# EAGLE schematic ChargerBase (EAGLE 7.2.0)
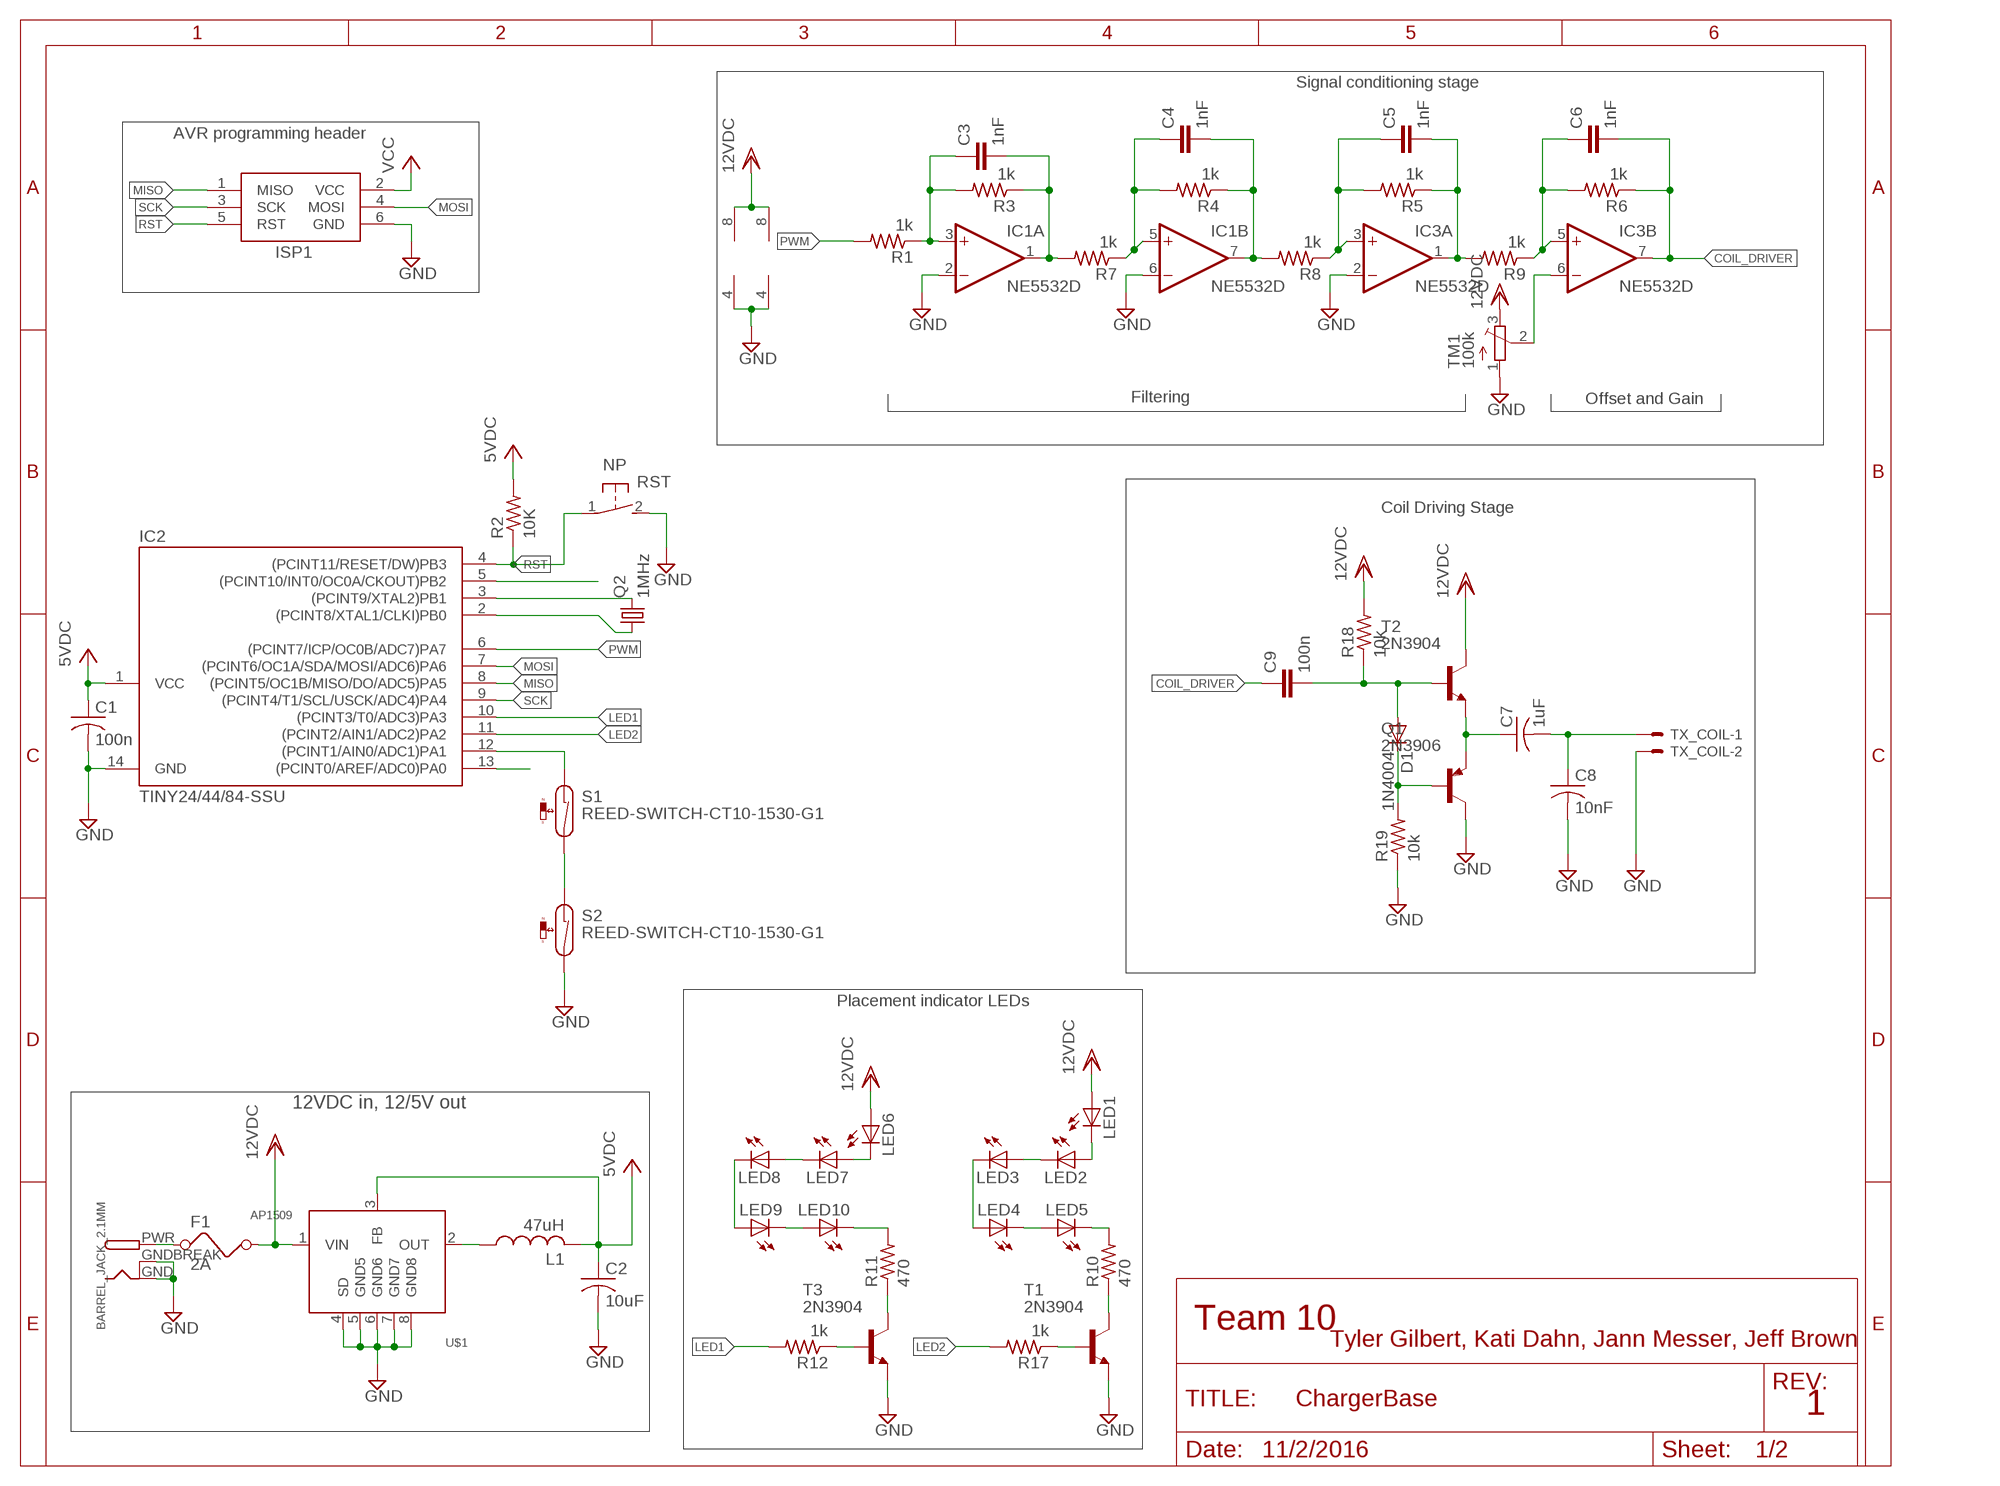
[diagram p0: schematic, sheet 1]

## Parts
BARREL_JACK_2.1MM  DCBARRELPTH  [DCJACK_2MM_PTH]
C1  100n  C-USC0805  [C0805]
C2  10uF  C-US025-040X050  [C025-040X050]
C3  1nF  C-EUC0805  [C0805]
C4  1nF  C-EUC0805  [C0805]
C5  1nF  C-EUC0805  [C0805]
C6  1nF  C-EUC0805  [C0805]
C7  1uF  C-US050-025X075  [C050-025X075]
C8  10nF  C-US050-025X075  [C050-025X075]
C9  100n  C-EUC0805  [C0805]
D1  1N4004  [DO41-10]
F1  2A  FUSE  [FUSE]
IC1  NE5532D  [SO08]
IC2  TINY24/44/84-SSU  [SOIC14]
IC3  NE5532D  [SO08]
ISP1  AVRISP-6  [AVRISP]
L1  47uH  L-US0207/7  [0207/7]
LED1  LEDCHIPLED_0805  [CHIPLED_0805]
LED2  LEDCHIPLED_0805  [CHIPLED_0805]
LED3  LEDCHIPLED_0805  [CHIPLED_0805]
LED4  LEDCHIPLED_0805  [CHIPLED_0805]
LED5  LEDCHIPLED_0805  [CHIPLED_0805]
LED6  LEDCHIPLED_0805  [CHIPLED_0805]
LED7  LEDCHIPLED_0805  [CHIPLED_0805]
LED8  LEDCHIPLED_0805  [CHIPLED_0805]
LED9  LEDCHIPLED_0805  [CHIPLED_0805]
LED10  LEDCHIPLED_0805  [CHIPLED_0805]
NP  RST  DTSM-3  [DTSM-3]
Q1  2N3906  [TO92]
Q2  1MHz  CRYSTALSM49  [SM49]
R1  1k  R-US_R0805  [R0805]
R2  10K  R-US_R0805  [R0805]
R3  1k  R-US_R0805  [R0805]
R4  1k  R-US_R0805  [R0805]
R5  1k  R-US_R0805  [R0805]
R6  1k  R-US_R0805  [R0805]
R7  1k  R-US_R0805  [R0805]
R8  1k  R-US_R0805  [R0805]
R9  1k  R-US_R0805  [R0805]
R10  470  R-US_R0805  [R0805]
R11  470  R-US_R0805  [R0805]
R12  1k  R-US_R0805  [R0805]
R17  1k  R-US_R0805  [R0805]
R18  10k  R-US_R0805  [R0805]
R19  10k  R-US_R0805  [R0805]
S1  REED-SWITCH-CT10-1530-G1  [CT10-G1]
S2  REED-SWITCH-CT10-1530-G1  [CT10-G1]
T1  2N3904  [TO92]
T2  2N3904  [TO92]
T3  2N3904  [TO92]
TM1  100k  TRIMPOTTC33X  [TC33X]
TX_COIL  22-23-2021  [22-23-2021]
U$1  AP1509  [SOP08]

## Nets
COIL_DRIVER: C6.2 C9.1 IC3.7(B:OUT) R6.1
GND: BARREL_JACK_2.1MM.GND BARREL_JACK_2.1MM.GNDBREAK C1.2 C2.2 C8.2 IC1.2(A:-IN) IC1.4(P:V-) IC1.6(B:-IN) IC2.14(GND) IC3.2(A:-IN) IC3.4(P:V-) ISP1.6(GND) NP.2 Q1.1(C) R19.1 S2.2 T1.3(E) T3.3(E) TM1.1(A) TX_COIL.2 U$1.4(SD) U$1.5(GND5) U$1.6(GND6) U$1.7(GND7) U$1.8(GND8)
LED1: IC2.10((PCINT3/T0/ADC3)PA3) R12.2
LED2: IC2.11((PCINT2/AIN1/ADC2)PA2) R17.2
MISO: IC2.8((PCINT5/OC1B/MISO/DO/ADC5)PA5) ISP1.1(MISO)
MOSI: IC2.7((PCINT6/OC1A/SDA/MOSI/ADC6)PA6) ISP1.4(MOSI)
N$1: C3.1 IC1.3(A:+IN) R1.1 R3.2
N$2: L1.1 U$1.2(OUT)
N$3: IC2.2((PCINT8/XTAL1/CLKI)PB0) Q2.1
N$4: IC2.3((PCINT9/XTAL2)PB1) Q2.2
N$5: IC2.5((PCINT10/INT0/OC0A/CKOUT)PB2)
N$6: LED6.C LED7.A
N$7: BARREL_JACK_2.1MM.PWR F1.1
N$8: C3.2 IC1.1(A:OUT) R3.1 R7.2
N$9: C4.1 IC1.5(B:+IN) R4.2 R7.1
N$10: C4.2 IC1.7(B:OUT) R4.1 R8.2
N$11: C5.1 IC3.3(A:+IN) R5.2 R8.1
N$12: C5.2 IC3.1(A:OUT) R5.1 R9.2
N$13: C6.1 IC3.5(B:+IN) R6.2 R9.1
N$14: R17.1 T1.2(B)
N$15: IC3.6(B:-IN) TM1.2(S)
N$16: R10.1 T1.1(C)
N$17: LED1.C LED2.A
N$18: LED2.C LED3.A
N$19: LED3.C LED4.A
N$20: LED4.C LED5.A
N$21: LED5.C R10.2
N$22: S1.2 S2.1
N$24: LED7.C LED8.A
N$25: LED8.C LED9.A
N$26: LED9.C LED10.A
N$27: C7.1 Q1.3(E) T2.3(E)
N$28: C9.2 D1.A R18.1 T2.2(B)
N$29: D1.C Q1.2(B) R19.2
N$30: C7.2 C8.1 TX_COIL.1
N$31: LED10.C R11.2
N$32: R11.1 T3.1(C)
N$33: R12.1 T3.2(B)
PIN12: IC2.12((PCINT1/AIN0/ADC1)PA1) S1.1
PIN13: IC2.13((PCINT0/AREF/ADC0)PA0)
PWM: IC2.6((PCINT7/ICP/OC0B/ADC7)PA7) R1.2
RST: IC2.4((PCINT11/RESET/DW)PB3) ISP1.5(RST) NP.1 R2.1
SCK: IC2.9((PCINT4/T1/SCL/USCK/ADC4)PA4) ISP1.3(SCK)
VCC: C1.1 C2.1 IC2.1(VCC) ISP1.2(VCC) L1.2 R2.2 U$1.3(FB) ; supply symbol labelled 5VDC
VDD: F1.2 IC1.8(P:V+) IC3.8(P:V+) LED1.A LED6.A R18.2 T2.1(C) TM1.3(E) U$1.1(VIN) ; supply symbol labelled 12VDC

## Notes on the sheet
- Signal conditioning stage
- AVR programming header
- Filtering | Offset and Gain
- Coil Driving Stage
- Placement indicator LEDs
- 12VDC in, 12/5V out

## Library data of the parts
BARREL_JACK_2.1MM = adafruit:DCBARREL: 2.0mm DC Barrel Jack DCJACK_2MM_PTH - Through Hole Jack (4UConnector: 05537)
C1 = rcl:C-US: CAPACITOR, American symbol
C2 C7 C8 = adafruit:C-US: CAPACITOR, American symbol
C3-C6 C9 = rcl:C-EU: CAPACITOR, European symbol
D1 = adafruit:1N4004: DIODE General purpose 1N400x type rectifier (With bigger pads) http://www.ladyada.net/library/pcb/eaglelibrary.html
F1 = special:FUSE: FUSE 5 x 20 mm
IC1 IC3 = linear:NE5532: AUDIO AMPLIFIER
IC2 = avr-5:TINY24/44/84
ISP1 = adafruit:AVRISP: AVR ISP HEADER Standard 6 pin header for AVR programming
L1 = rcl:L-US: INDUCTOR, American symbol
LED1-LED10 = led:LED: LED OSRAM: - CHIPLED LG R971, LG N971, LY N971, LG Q971, LY Q971, LO R971, LY R971 LH N974, LH R974 LS Q976, LO Q976, LY Q976 LO Q996 - Hyper CHIPLED LW Q18S LB Q993, LB Q99A, LB R99A - SideLED LS A670, LO A670, LY A670, LG A670, LP A670 LB A673, LV A673, LT A673, LW A673 LH A674 LY A675 LS A676, LA A676, LO A676, LY A676, LW A676 LS A679, LY A679, LG A679 - Hyper Micro SIDELED® LS Y876, LA Y876, LO Y876, LY Y876 LT Y87S - SmartLED LW L88C, LW L88S LB L89C, LB L89S, LG L890 LS L89K, LO L89K, LY L89K LS L896, LA L896, LO L896, LY L896 - TOPLED LS T670, LO T670, LY T670, LG T670, LP T670 LSG T670, LSP T670, LSY T670, LOP T670, LYG T670 LG T671, LOG T671, LSG T671 LB T673, LV T673, LT T673, LW T673 LH T674 LS T676, LA T676, LO T676, LY T676, LB T676, LH T676, LSB T676, LW T676 LB T67C, LV T67C, LT T67C, LS T67K, LO T67K, LY T67K, LW E67C LS E67B, LA E67B, LO E67B, LY E67B, LB E67C, LV E67C, LT E67C LW T67C LS T679, LY T679, LG T679 LS T770, LO T770, LY T770, LG T770, LP T770 LB T773, LV T773, LT T773, LW T773 LH T774 LS E675, LA E675, LY E675, LS T675 LS T776, LA T776, LO T776, LY T776, LB T776 LHGB T686 LT T68C, LB T68C - Hyper Mini TOPLED® LB M676 - Mini TOPLED Santana® LG M470 LS M47K, LO M47K, LY M47K Source: http://www.osram.convergy.de LUXEON: - LUMILED® LXK2-PW12-R00, LXK2-PW12-S00, LXK2-PW14-U00, LXK2-PW14-V00 LXK2-PM12-R00, LXK2-PM12-S00, LXK2-PM14-U00 LXK2-PE12-Q00, LXK2-PE12-R00, LXK2-PE12-S00, LXK2-PE14-T00, LXK2-PE14-U00 LXK2-PB12-K00, LXK2-PB12-L00, LXK2-PB12-M00, LXK2-PB14-N00, LXK2-PB14-P00, LXK2-PB14-Q00 LXK2-PR12-L00, LXK2-PR12-M00, LXK2-PR14-Q00, LXK2-PR14-R00 LXK2-PD12-Q00, LXK2-PD12-R00, LXK2-PD12-S00 LXK2-PH12-R00, LXK2-PH12-S00 LXK2-PL12-P00, LXK2-PL12-Q00, LXK2-PL12-R00 Source: www.luxeon.com KINGBRIGHT: KA-3528ASYC Source: www.kingbright.com
NP = switch-tact:DTSM-3
Q1 = transistor-pnp:2N3906: PNP Transistor
Q2 = adafruit:CRYSTAL: CRYSTAL; OC_FARNELL: unknown; OC_NEWARK: unknown
R1-R12 R17-R19 = rcl:R-US_: RESISTOR, American symbol
S1 S2 = switch-reed:REED-SWITCH-: Reed Sensor; MF: COTO TECHNOLOGY; MPN: CT10-1530-G1; OC_FARNELL: 1081696
T1-T3 = transistor:2N3904: NPN TRANSISTOR
TM1 = adafruit:TRIMPOT: SMT trimmer potentiometer part number TC33X http://www.ladyada.net/library/eagle
TX_COIL = con-molex:22-23-2021: .100" (2.54mm) Center Header - 2 Pin; MF: MOLEX; MPN: 22-23-2021; OC_FARNELL: 1462926; OC_NEWARK: 25C3832
U$1 = _VMS:AP1509